# Altium schematic sheet mini3216时钟V3.0.SchDoc
size A3
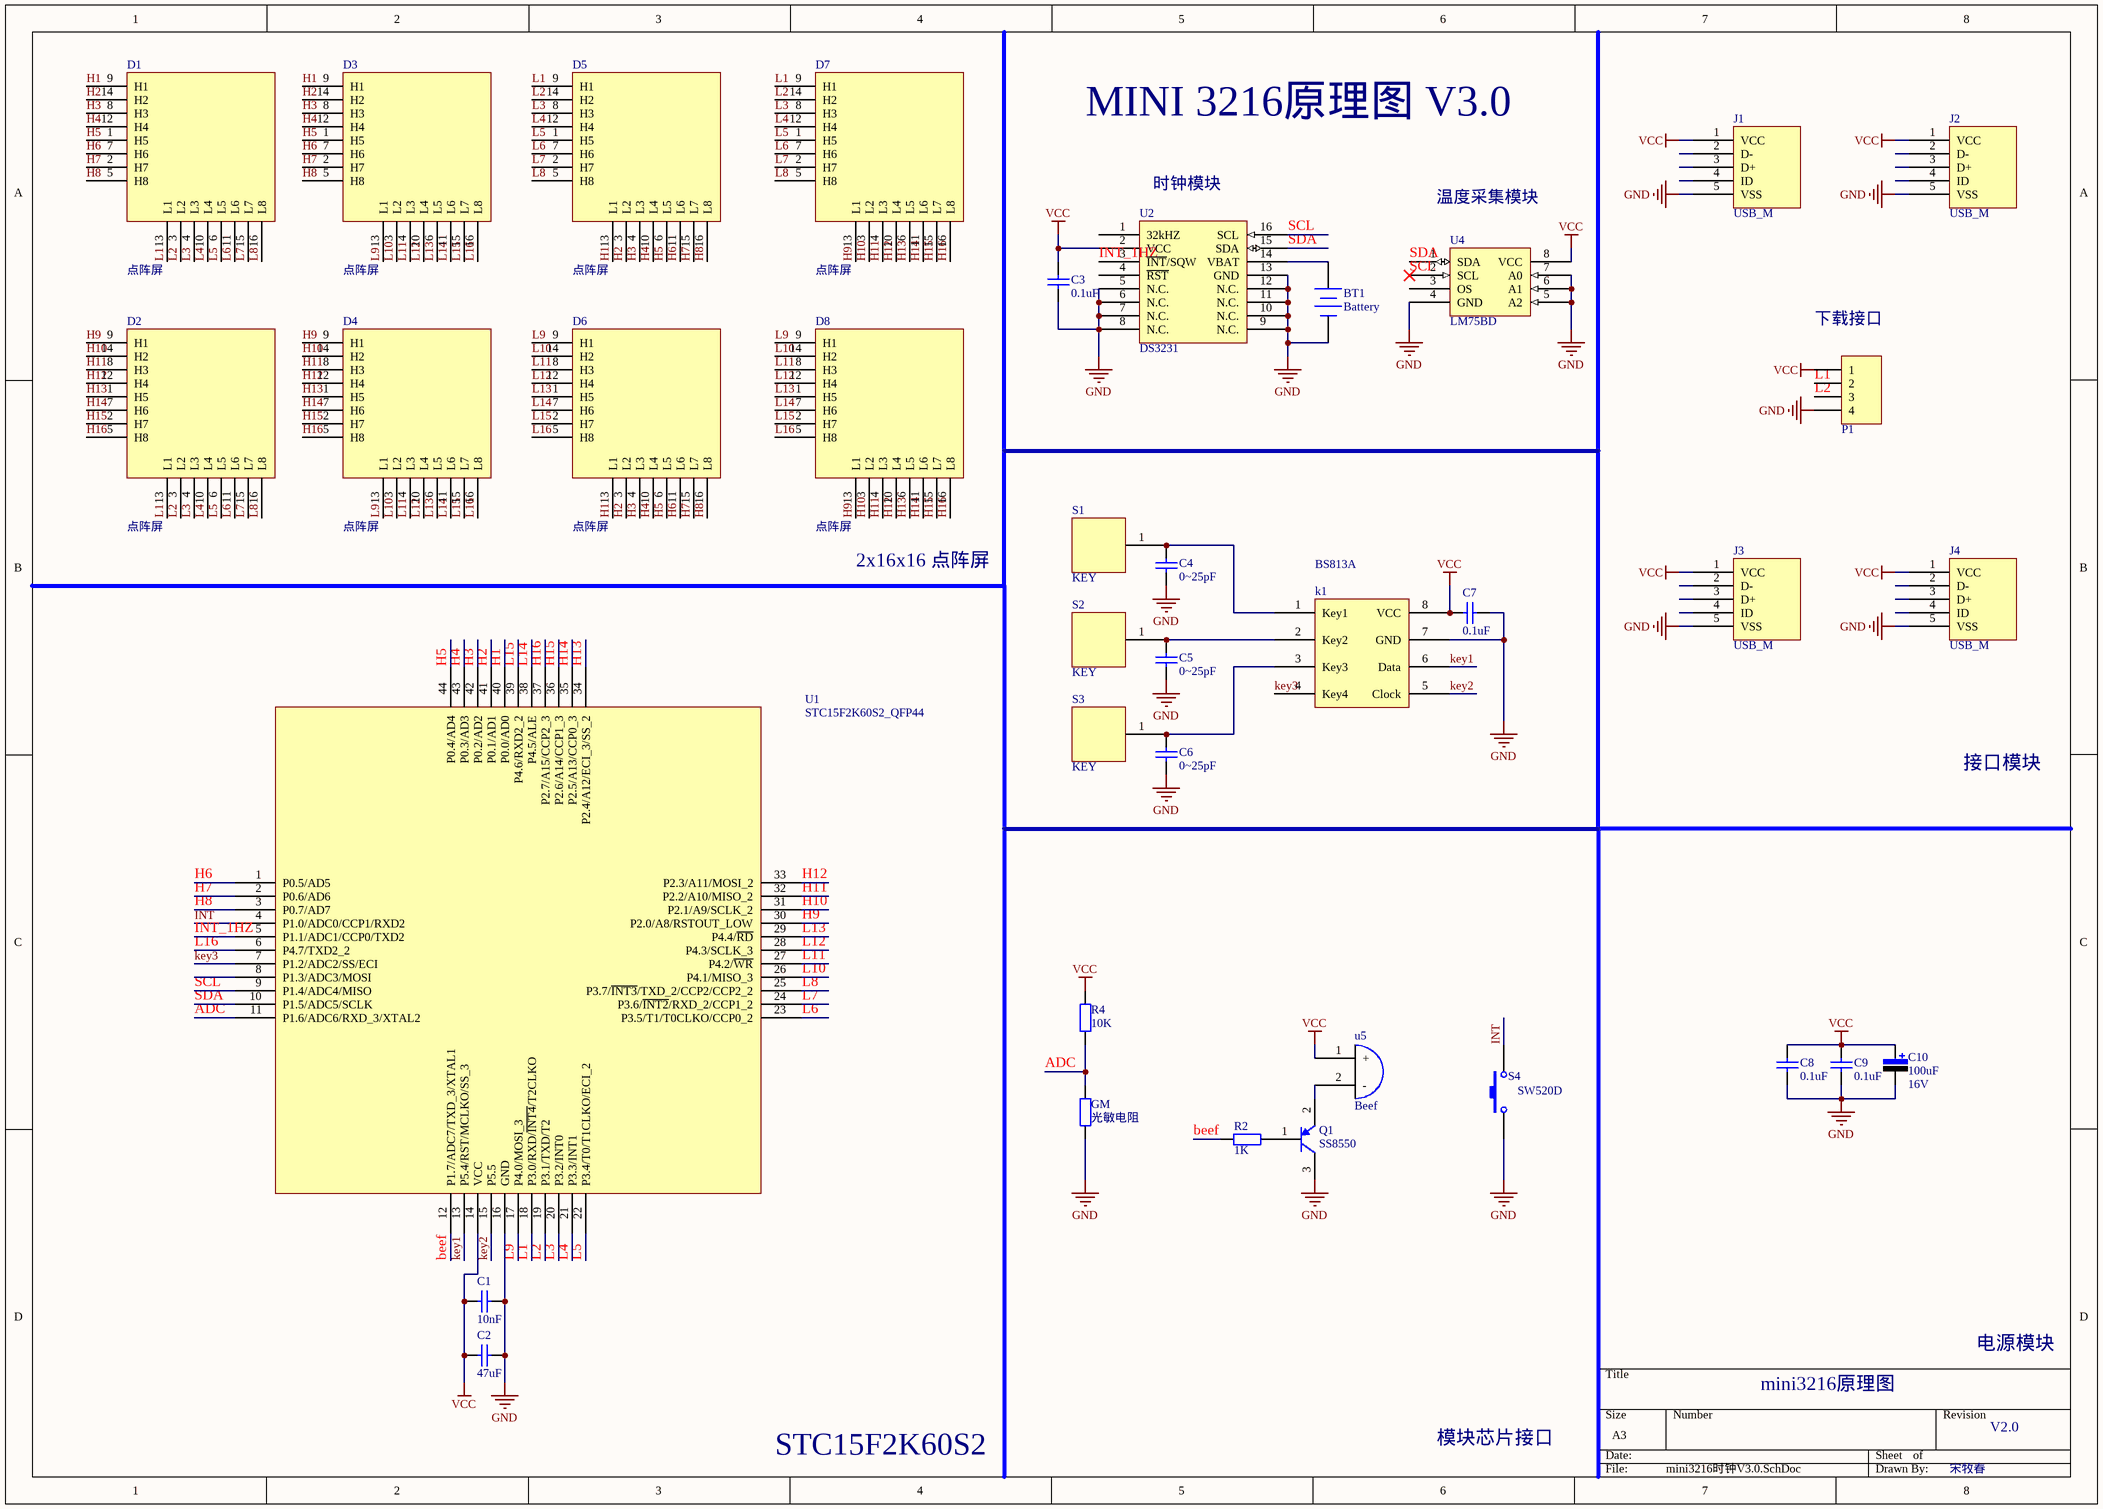
[diagram p0: mini3216时钟V3.0.SchDoc]

## Parts
BT1  Battery  [CR1220电池座]
C1  value 10nF  [C-RAD-0805]  (hidden comment: Cap)
C2  value 47uF  [1206(3216)]  (hidden comment: Cap)
C3  value 0.1uF  [C-RAD-0805]  (hidden comment: Cap)
C4  value 0~25pF  [C-RAD-0805]  (hidden comment: Cap)
C5  value 0~25pF  [C-RAD-0805]  (hidden comment: Cap)
C6  value 0~25pF  [C-RAD-0805]  (hidden comment: Cap)
C7  value 0.1uF  [C-RAD-0805]  (hidden comment: Cap)
C8  value 0.1uF  [C-RAD-0805]  (hidden comment: Cap)
C9  value 0.1uF  [C-RAD-0805]  (hidden comment: Cap)
C10  value 100uF  Vol: 16V  [CAP-3528]  (hidden comment: Cap Pol)
D1  点阵屏  [LED_点阵1088]
D2  点阵屏  [LED_点阵1088]
D3  点阵屏  [LED_点阵1088]
D4  点阵屏  [LED_点阵1088]
D5  点阵屏  [LED_点阵1088]
D6  点阵屏  [LED_点阵1088]
D7  点阵屏  [LED_点阵1088]
D8  点阵屏  [LED_点阵1088]
GM  value 光敏电阻  [光敏电阻]  (hidden comment: Res1)
J1  USB_M  [USB_MICRO]
J2  USB_M  [USB_MICRO]
J3  USB_M  [USB_MICRO]
J4  USB_M  [USB_MICRO]
k1  BS813A  [SOP8]
P1  Header 4  [HDR4X1_A]  (value not drawn)
Q1  SS8550  [SOT-23]
R2  value 1K  [0805-1]  (hidden comment: Res1)
R4  value 10K  [0805-1]  (hidden comment: Res1)
S1  KEY  [KEY1]
S2  KEY  [KEY2]
S3  KEY  [KEY3]
S4  SW520D  [SW_PB2_A1]
U1  STC15F2K60S2_QFP44  [LQFP44]
U2  DS3231  [DS3231SN]
U4  LM75BD  [LM75BD]
u5  Beef  [BEEF]

## Nets
GND: BT1.2(-) C1.2 C2.2 C3.1 C4.1 C5.1 C6.1 C7.2 C8.1 C9.1 C10.2 GM.1 J1.5(VSS) J2.5(VSS) J3.5(VSS) J4.5(VSS) k1.7(GND) P1.4 Q1.3(C) S4.1 U1.16(GND) U2.5(N.C.) U2.6(N.C.) U2.7(N.C.) U2.8(N.C.) U2.9(N.C.) U2.10(N.C.) U2.11(N.C.) U2.12(N.C.) U2.13(GND) U4.4(GND) U4.5(A2) U4.6(A1) U4.7(A0)
VCC: C1.1 C2.1 C3.2 C7.1 C8.2 C9.2 C10.1 J1.1(VCC) J2.1(VCC) J3.1(VCC) J4.1(VCC) k1.8(VCC) P1.1 R4.2 U1.14(VCC) U2.2(VCC) U4.8(VCC) u5.1(+)
ADC: GM.2 R4.1 U1.11(P1.6/ADC6/RXD_3/XTAL2)
beef: R2.1 U1.12(P1.7/ADC7/TXD_3/XTAL1)
H1: D1.9(H1) D3.9(H1) D5.13(L1) D6.13(L1) U1.40(P0.0/AD0)
H2: D1.14(H2) D3.14(H2) D5.3(L2) D6.3(L2) U1.41(P0.1/AD1)
H3: D1.8(H3) D3.8(H3) D5.4(L3) D6.4(L3) U1.42(P0.2/AD2)
H4: D1.12(H4) D3.12(H4) D5.10(L4) D6.10(L4) U1.43(P0.3/AD3)
H5: D1.1(H5) D3.1(H5) D5.6(L5) D6.6(L5) U1.44(P0.4/AD4)
H6: D1.7(H6) D3.7(H6) D5.11(L6) D6.11(L6) U1.1(P0.5/AD5)
H7: D1.2(H7) D3.2(H7) D5.15(L7) D6.15(L7) U1.2(P0.6/AD6)
H8: D1.5(H8) D3.5(H8) D5.16(L8) D6.16(L8) U1.3(P0.7/AD7)
H9: D2.9(H1) D4.9(H1) D7.13(L1) D8.13(L1) U1.30(P2.0/A8/RSTOUT_LOW)
H10: D2.14(H2) D4.14(H2) D7.3(L2) D8.3(L2) U1.31(P2.1/A9/SCLK_2)
H11: D2.8(H3) D4.8(H3) D7.4(L3) D8.4(L3) U1.32(P2.2/A10/MISO_2)
H12: D2.12(H4) D4.12(H4) D7.10(L4) D8.10(L4) U1.33(P2.3/A11/MOSI_2)
H13: D2.1(H5) D4.1(H5) D7.6(L5) D8.6(L5) U1.34(P2.4/A12/ECI_3/SS_2)
H14: D2.7(H6) D4.7(H6) D7.11(L6) D8.11(L6) U1.35(P2.5/A13/CCP0_3)
H15: D2.2(H7) D4.2(H7) D7.15(L7) D8.15(L7) U1.36(P2.6/A14/CCP1_3)
H16: D2.5(H8) D4.5(H8) D7.16(L8) D8.16(L8) U1.37(P2.7/A15/CCP2_3)
INT: S4.2 U1.4(P1.0/ADC0/CCP1/RXD2)
INT_1HZ: U1.5(P1.1/ADC1/CCP0/TXD2) U2.3(~{INT}/SQW)
key1: k1.6(Data) U1.13(P5.4/RST/MCLKO/SS_3)
key2: k1.5(Clock) U1.15(P5.5)
key3: k1.4(Key4) U1.7(P1.2/ADC2/SS/ECI)
L1: D1.13(L1) D2.13(L1) D5.9(H1) D7.9(H1) P1.2 U1.18(P3.0/RXD/~{INT4}/T2CLKO)
L2: D1.3(L2) D2.3(L2) D5.14(H2) D7.14(H2) P1.3 U1.19(P3.1/TXD/T2)
L3: D1.4(L3) D2.4(L3) D5.8(H3) D7.8(H3) U1.20(P3.2/INT0)
L4: D1.10(L4) D2.10(L4) D5.12(H4) D7.12(H4) U1.21(P3.3/INT1)
L5: D1.6(L5) D2.6(L5) D5.1(H5) D7.1(H5) U1.22(P3.4/T0/T1CLKO/ECI_2)
L6: D1.11(L6) D2.11(L6) D5.7(H6) D7.7(H6) U1.23(P3.5/T1/T0CLKO/CCP0_2)
L7: D1.15(L7) D2.15(L7) D5.2(H7) D7.2(H7) U1.24(P3.6/~{INT2}/RXD_2/CCP1_2)
L8: D1.16(L8) D2.16(L8) D5.5(H8) D7.5(H8) U1.25(P3.7/~{INT3}/TXD_2/CCP2/CCP2_2)
L9: D3.13(L1) D4.13(L1) D6.9(H1) D8.9(H1) U1.17(P4.0/MOSI_3)
L10: D3.3(L2) D4.3(L2) D6.14(H2) D8.14(H2) U1.26(P4.1/MISO_3)
L11: D3.4(L3) D4.4(L3) D6.8(H3) D8.8(H3) U1.27(P4.2/~{WR})
L12: D3.10(L4) D4.10(L4) D6.12(H4) D8.12(H4) U1.28(P4.3/SCLK_3)
L13: D3.6(L5) D4.6(L5) D6.1(H5) D8.1(H5) U1.29(P4.4/~{RD})
L14: D3.11(L6) D4.11(L6) D6.7(H6) D8.7(H6) U1.38(P4.5/ALE)
L15: D3.15(L7) D4.15(L7) D6.2(H7) D8.2(H7) U1.39(P4.6/RXD2_2)
L16: D3.16(L8) D4.16(L8) D6.5(H8) D8.5(H8) U1.6(P4.7/TXD2_2)
SCL: U1.9(P1.4/ADC4/MISO) U2.16(SCL) U4.2(SCL)
SDA: U1.10(P1.5/ADC5/SCLK) U2.15(SDA) U4.1(SDA)
NetBT1_1: BT1.1(+) U2.14(VBAT)
NetC4_2: C4.2 k1.1(Key1) S1.1
NetC5_2: C5.2 k1.2(Key2) S2.1
NetC6_2: C6.2 k1.3(Key3) S3.1
NetQ1_1: Q1.1(B) R2.2
NetQ1_2: Q1.2(E) u5.2(-)

Not connected (* = marked no-connect by the designer): J1 2(D-) 3(D+) 4(ID); J2 2(D-) 3(D+) 4(ID); J3 2(D-) 3(D+) 4(ID); J4 2(D-) 3(D+) 4(ID); U1 8(P1.3/ADC3/MOSI); U2 1(32kHZ) 4(~{RST}); U4 3(OS)

## Notes on the sheet
- MINI 3216原理图 V3.0
- (near U2) 时钟模块
- 温度采集模块
- (near P1) 下载接口
- 2x16x16 点阵屏
- 接口模块
- mini3216原理图
- 电源模块
- STC15F2K60S2
- 模块芯片接口
- V2.0
- 宋牧春

## Library data of the parts
BT1 = Battery: 备份电池; Published: 24-Mar-1999; LatestRevisionDate: 17-Jul-2002; LatestRevisionNote: Re-released for DXP Platform.; PackageReference: BAT-2; Publisher: Altium Limited
C1-C9 = Cap: 无极性电容; Published: 8-Jun-2000; LatestRevisionDate: 17-Jul-2002; LatestRevisionNote: Re-released for DXP Platform.; PackageReference: RAD-0.3; Publisher: Altium Limited
C10 = Cap Pol: 极性电解电容; Published: 8-Jun-2000; LatestRevisionDate: 17-Jul-2002; LatestRevisionNote: Re-released for DXP Platform.; PackageReference: RB7.6-15; Publisher: Altium Limited
D1-D8 = LED_点阵屏8x8
GM R2 R4 = Res1: 贴片电阻; Published: 8-Jun-2000; LatestRevisionDate: 17-Jul-2002; LatestRevisionNote: Re-released for DXP Platform.; PackageReference: AXIAL-0.4; Publisher: Altium Limited
J1-J4 = USB_M: MicroUSB接口
k1 = BS814A-2触摸按键
P1 = Header 4: 接插件; LatestRevisionDate: 17-Jul-2002; LatestRevisionNote: Re-released for DXP Platform.; Publisher: Altium Limited
Q1 = SS8550: PNP贴片三极管; Published: 8-Jun-2000; LatestRevisionDate: 15-Jan-2003; LatestRevisionNote: PCB Footprint 'BCY-W3/D4.7' replaced; DatasheetDocument: 1997; PackageDocument: Sep-1998; PackageReference: TO-92A; Publisher: Altium Limited; Code_JEDEC: TO-92A; ComponentLink1Description: Manufacturer Link; ComponentLink1URL: http://www.fairchildsemi.com/; ComponentLink2Description: Datasheet; ComponentLink2URL: http://www.fairchildsemi.com/ds/2N%2F2N3906.pdf
S1-S3 = TouchKEY
S4 = SW-PB: 微动开关; Published: 24-Mar-1999; LatestRevisionDate: 17-Jul-2002; LatestRevisionNote: Re-released for DXP Platform.; PackageReference: SPST-2; Publisher: Altium Limited